# EAGLE design  E104-BT5005A (EAGLE 9.5.2)
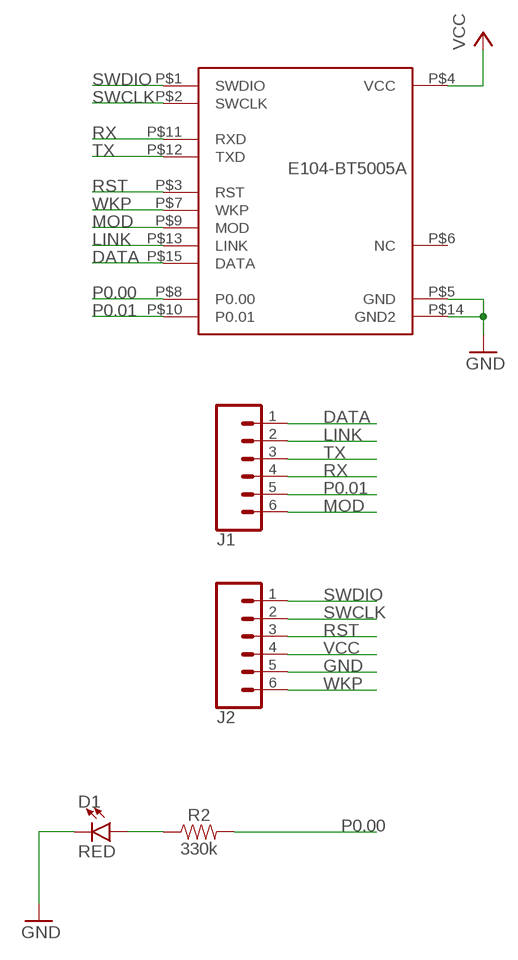
[diagram p0: schematic, sheet 1]

## Parts
D1  RED  LED-RED0603  [LED-0603]
J1  CONN_06SILK_FEMALE_PTH  [1X06]
J2  CONN_06SILK_FEMALE_PTH  [1X06]
R2  330k  330KOHM-0603-1/10W-1%  [0603]
U$1  E104-BT5005A  [E104-BT5005A]

## Nets
DATA: J1.1 U$1.P$15(DATA)
GND: D1.C J2.5 U$1.P$5(GND) U$1.P$14(GND2)
LINK: J1.2 U$1.P$13(LINK)
MOD: J1.6 U$1.P$9(MOD)
N$1: D1.A R2.1
P0.00: R2.2 U$1.P$8(P0.00)
P0.01: J1.5 U$1.P$10(P0.01)
RST: J2.3 U$1.P$3(RST)
RX: J1.4 U$1.P$11(RXD)
SWCLK: J2.2 U$1.P$2(SWCLK)
SWDIO: J2.1 U$1.P$1(SWDIO)
TX: J1.3 U$1.P$12(TXD)
VCC: J2.4 U$1.P$4(VCC)
WKP: J2.6 U$1.P$7(WKP)
Unconnected: U$1.P$6(NC)

## Library data of the parts
D1 = SparkFun-LED:LED-RED: Red SMD LED Used in manufacturing of most products at SparkFun Packages: 0603 - SMD 0603 package [Product Link] <http://docs.avagotech.com/docs/AV02-0551EN> 0603 SMART - SMD 0603 SMART package ( more efficient and expensive)[Product Link] <http://www.osram-os.com/Graphics/XPic2/00077099_0.pdf> 1206 - SMD1206 package [Product Link] <https://www.sparkfun.com/datasheets/DevTools/LilyPad/Q150OVS4.pdff> SparkFun Products: Pro Mini 328 -5V <https://www.sparkfun.com/products/821> RedBoard <https://www.sparkfun.com/products/12757> IOIO-OTG <https://www.sparkfun.com/products/13613>; PROD_ID: DIO-00819
J1 J2 = SparkFun-Connectors:CONN_06: Multi connection point. Often used as Generic Header-pin footprint for 0.1 inch spaced/style header connections On any of the 0.1 inch spaced packages, you can populate with these: Break Away Headers - Straight <https://www.sparkfun.com/products/116> (PRT-00116) Break Away Male Headers - Right Angle <https://www.sparkfun.com/products/553> (PRT-00553) Female Headers <https://www.sparkfun.com/products/115> (PRT-00115) Break Away Headers - Machine Pin <https://www.sparkfun.com/products/117> (PRT-00117) Break Away Female Headers - Swiss Machine Pin <https://www.sparkfun.com/products/743> (PRT-00743) Arduino Stackable Header - 6 Pin <https://www.sparkfun.com/products/9280> (PRT-09280) For SCREWTERMINALS and SPRING TERMINALS visit here: Screw Terimnals on SparkFun.com <https://www.sparkfun.com/search/results?term=Screw+Terminals> (5mm/3.5mm/2.54mm spacing) This device is also useful as a general connection point to wire up your design to another part of your project. Our various solder wires solder well into these plated through hole pads. Hook-Up Wire - Assortment (Stranded, 22 AWG) <https://www.sparkfun.com/products/11375> (PRT-11375) Hook-Up Wire - Assortment (Solid Core, 22 AWG) <https://www.sparkfun.com/products/11367> (PRT-11367) View the entire wire category on our website here <https://www.sparkfun.com/categories/141>; PROD_ID: CONN-08437
R2 = SparkFun-Resistors:330KOHM: 330kΩ resistor A resistor is a passive two-terminal electrical component that implements electrical resistance as a circuit element. Resistors act to reduce current flow, and, at the same time, act to lower voltage levels within circuits. - Wikipedia; PROD_ID: RES-08968
U$1 =  E104-BT5005A:E104-BT5005A

## Board
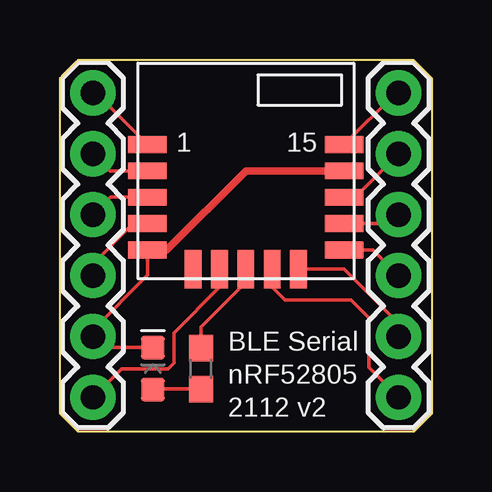
[diagram p1: board, top side]
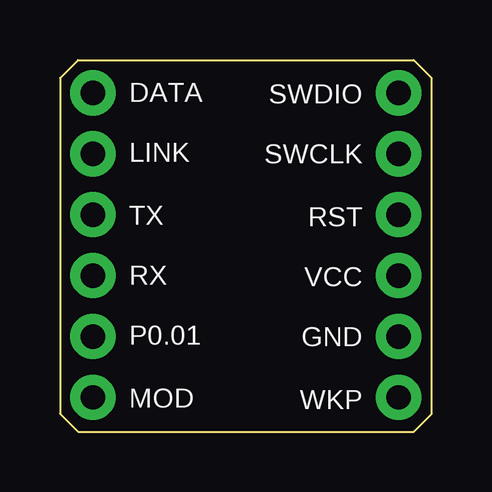
[diagram p2: board, bottom side, seen from below]

Size 15.5 x 15.5 mm. Coordinates in mm from the lower left corner, seen from the top.
Outline: 0,14.75 0.75,15.5 14.75,15.5 15.5,14.75 15.5,0.75 14.75,0 0.75,0 0,0.75 0,14.75
Copper layers (1*16): Top 0.035559375mm / dielectric 1.6mm / Bottom 0.035559375mm
Design rules "oshpark-2layer": minimum track width 6mil, minimum drill 10mil, track to track 6mil, track to pad 6mil, pad to pad 6mil, via to via 6mil, smd to smd 6mil, copper to edge 15mil, drill to drill 6mil, minimum pad ring 5mil, minimum via ring 5mil, stop-mask expansion 2.5mil, vias tented up to drill 0mil, thermal gap 10mil

### Footprints (pad centres in the part's own frame; a part is rotated, then mirrored left to right if it is on the bottom)
LED-0603 = smd 1 x 1: A -0.877,0; C 0.877,0
1X06 = drill 1.016 pad 1.88: 1 0,0; 2 2.54,0; 3 5.08,0; 4 7.62,0; 5 10.16,0; 6 12.7,0
0603 = smd 1.1 x 1: 1 -0.85,0; 2 0.85,0
E104-BT5005A = smd 1.6 x 0.7: P$1 0.4,5.6; P$2 0.4,4.5; P$3 0.4,3.4; P$4 0.4,2.3; P$5 0.4,1.2; P$11 8.6,1.2; P$12 8.6,2.3; P$13 8.6,3.4; P$14 8.6,4.5; P$15 8.6,5.6 | smd 0.7 x 1.6: P$6 2.3,0.4; P$7 3.4,0.4; P$8 4.5,0.4; P$9 5.6,0.4; P$10 6.7,0.4

### Placement (x,y rotation side)
D1  3.88,2.62 90 top
J1  14.12,14.12 270 top
J2  1.38,14.12 270 top
R2  5.88,2.62 90 top
U$1  3.25,6.38 0 top

### Tracks (layer width: path | path; a pad name or v marks a point on that pad's centre or on a via)
DATA
  Top 0.152: U$1.P$15 14,14.12 J1.1
GND
  Top 0.152: U$1.P$5 3.65,6.53 1.38,4.25 J2.5 1.84,3.5 D1.C
  Top 0.305: U$1.P$5 4.45,7.58 7.75,10.88 U$1.P$14
LINK
  Top 0.152: U$1.P$13 12.31,9.78 J1.2
MOD
  Top 0.152: U$1.P$9 8.85,6.03 9.38,5.5 12.12,5.5 12.88,4.75 12.88,2.67 J1.6
N$1
  Top 0.152: D1.A 3.9,1.77 R2.1
P0.00
  Top 0.152: U$1.P$8 7.75,6.25 5.88,4.38 R2.2
P0.01
  Top 0.152: U$1.P$10 11.85,6.78 14.12,4.5 J1.5
RST
  Top 0.152: U$1.P$3 2.1,9.78 J2.3
RX
  Top 0.152: U$1.P$11 13.05,7.58 J1.4
SWCLK
  Top 0.152: U$1.P$2 2.08,10.88 J2.2
SWDIO
  Top 0.152: U$1.P$1 1.5,14.12 J2.1
TX
  Top 0.152: U$1.P$12 13.76,8.68 J1.3
VCC
  Top 0.152: U$1.P$4 3.05,8.68 1.38,7 J2.4
WKP
  Top 0.152: U$1.P$7 6.65,6.03 4.75,4.12 4.75,2.88 4.5,2.62 2.58,2.62 J2.6

### Text on the board
tPlace: BLE Serial | nRF52805 | 2112 v2
bPlace: SWDIO | DATA | SWCLK | LINK | RST | TX | VCC | RX | GND | P0.01 | WKP | MOD